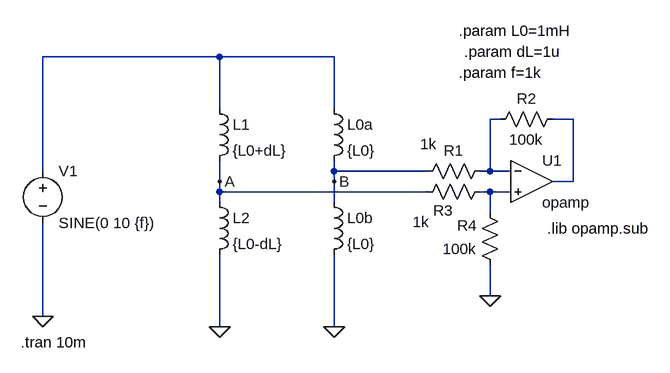
[diagram p0: schematic Klausur_SS_2008_1.asc]
Klausur_SS_2008_1.asc, the LTspice schematic file:
Version 4
SHEET 1 880 680
WIRE 64 0 -208 0
WIRE 240 0 64 0
WIRE 64 80 64 0
WIRE 240 80 240 0
WIRE 496 96 480 96
WIRE 608 96 576 96
WIRE -208 176 -208 0
WIRE 240 176 240 160
WIRE 384 176 240 176
WIRE 480 176 480 96
WIRE 480 176 464 176
WIRE 512 176 480 176
WIRE 64 192 64 160
WIRE 240 192 240 176
WIRE 608 192 608 96
WIRE 608 192 576 192
WIRE 64 208 64 192
WIRE 384 208 64 208
WIRE 480 208 464 208
WIRE 512 208 480 208
WIRE 64 224 64 208
WIRE 240 224 240 192
WIRE 480 240 480 208
WIRE 480 368 480 320
WIRE -208 400 -208 256
WIRE 64 416 64 304
WIRE 240 416 240 304
FLAG -208 400 0
FLAG 64 416 0
FLAG 240 416 0
FLAG 64 192 A
FLAG 240 192 B
FLAG 480 368 0
SYMBOL ind 48 64 R0
SYMATTR InstName L1
SYMATTR Value {L0+dL}
SYMBOL ind 48 208 R0
SYMATTR InstName L2
SYMATTR Value {L0-dL}
SYMBOL ind 224 64 R0
SYMATTR InstName L0a
SYMATTR Value {L0}
SYMBOL ind 224 208 R0
SYMATTR InstName L0b
SYMATTR Value {L0}
SYMBOL voltage -208 160 R0
WINDOW 123 0 0 Left 2
WINDOW 39 0 0 Left 2
SYMATTR InstName V1
SYMATTR Value SINE(0 10 {f})
SYMBOL Opamps\\opamp 544 128 R0
SYMATTR InstName U1
SYMBOL res 480 160 R90
WINDOW 0 0 56 VBottom 2
WINDOW 3 -41 95 VTop 2
SYMATTR InstName R1
SYMATTR Value 1k
SYMBOL res 480 192 R90
WINDOW 0 60 72 VBottom 2
WINDOW 3 47 106 VTop 2
SYMATTR InstName R3
SYMATTR Value 1k
SYMBOL res 496 336 R180
WINDOW 0 36 76 Left 2
WINDOW 3 36 40 Left 2
SYMATTR InstName R4
SYMATTR Value 100k
SYMBOL res 480 112 R270
WINDOW 0 32 56 VTop 2
WINDOW 3 0 56 VBottom 2
SYMATTR InstName R2
SYMATTR Value 100k
TEXT 432 -40 Left 2 !.param L0=1mH
TEXT 440 -8 Left 2 !.param dL=1u
TEXT 432 24 Left 2 !.param f=1k
TEXT -242 440 Left 2 !.tran 10m
TEXT 568 264 Left 2 !.lib opamp.sub

The netlist it stands for:
* Klausur_SS_2008_1.asc
L1 N001 A {L0+dL}
L2 A 0 {L0-dL}
L0a N001 B {L0}
L0b B 0 {L0}
V1 N001 0 SINE(0 10 {f})
XU1 N002 N004 N003 opamp Aol=100K GBW=10Meg  ; pins invin noninvin out
R1 N002 B 1k
R3 N004 A 1k
R4 0 N004 100k
R2 N002 N003 100k
.param L0=1mH
.param dL=1u
.param f=1k
.tran 10m
.lib opamp.sub
.backanno
.end